# Altium schematic sheet ESP32_TFT1.8_LORASPI.SchDoc
size A4; SheetNumber: 1; SheetTotal: 2
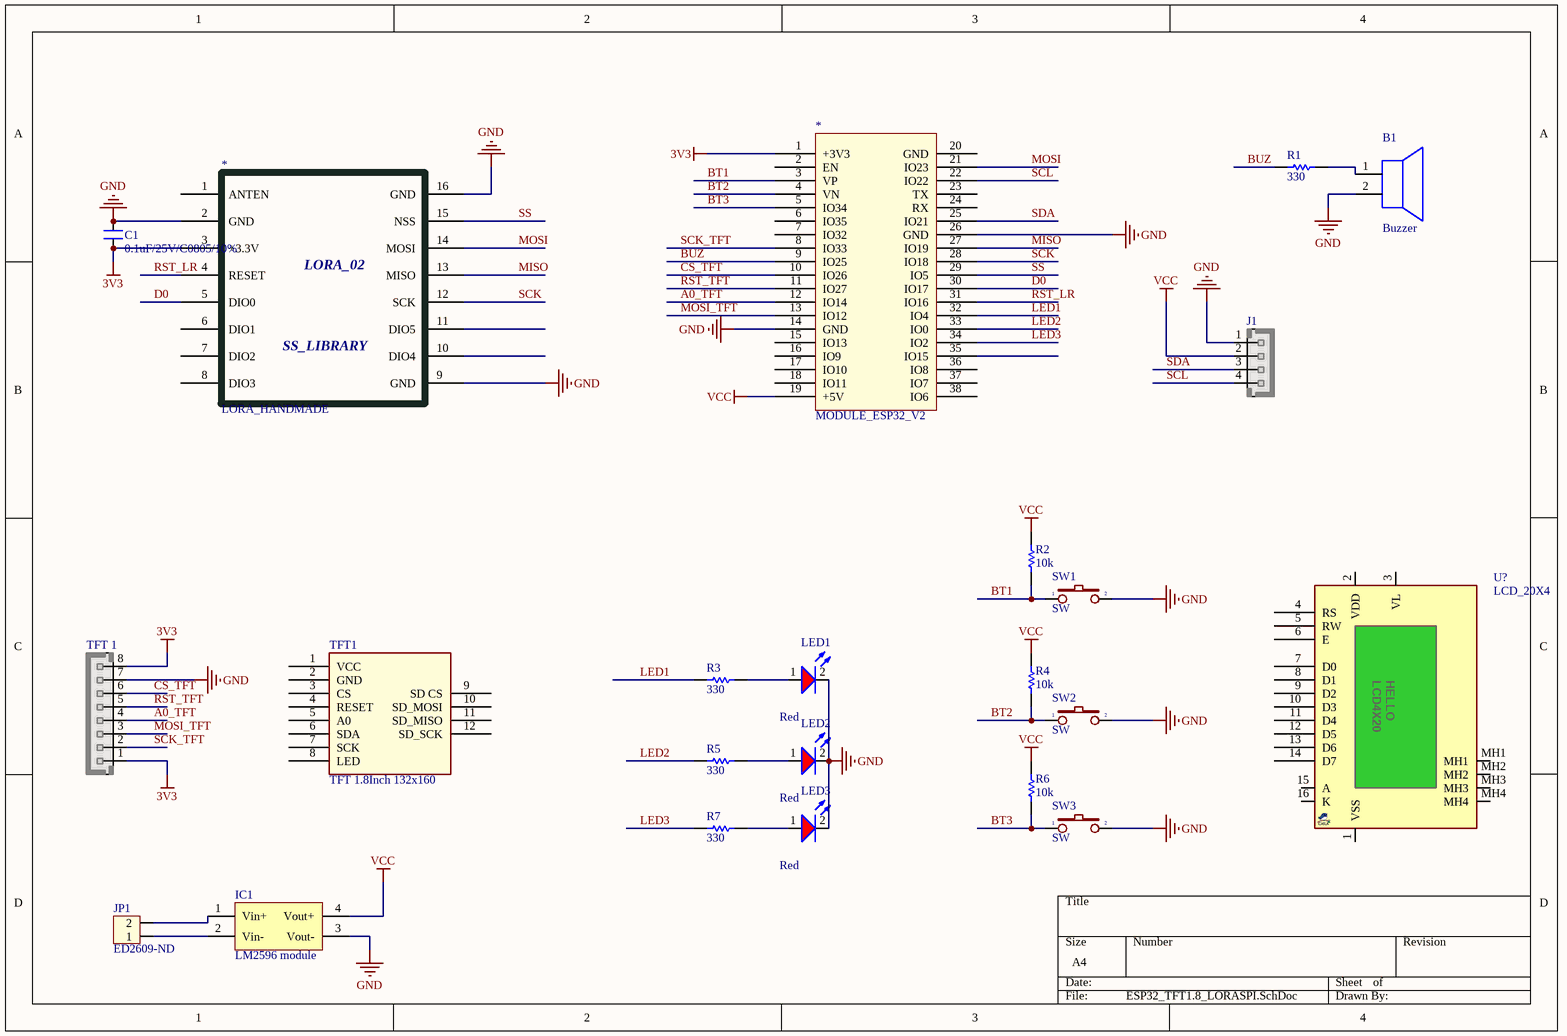
[diagram p0: ESP32_TFT1.8_LORASPI.SchDoc]

## Parts
(Parts that share a designator on the sheet are numbered #1, #2 ... from top to bottom, then left to right.)
*#1  MODULE_ESP32_V2  [MODULE_ESP32_V2]
*#2  LORA_HANDMADE  [LORA_HANDMADE]
B1  Buzzer  [Buzzer]
C1  0.1uF/25V/C0805/10%  [CAP_CERA_C2012(CC0805INCH)]
IC1  LM2596 module  [LM2596 Module]
J1  HHDR_4  [XH_4]  (value not drawn)
JP1  ED2609-ND  [DOMINO_OSTTC_2P]
LED1  value Red  [LED3R]  (hidden comment: LED_R_3)
LED2  value Red  [LED3R]  (hidden comment: LED_R_3)
LED3  value Red  [LED3R]  (hidden comment: LED_R_3)
R1  330  [Res 0805 SMD]
R2  10k  [Res 0805 SMD]
R3  330  [Res 0805 SMD]
R4  10k  [Res 0805 SMD]
R5  330  [Res 0805 SMD]
R6  10k  [Res 0805 SMD]
R7  330  [Res 0805 SMD]
SW1  SW  [BUTTON 2PIN TRON]
SW2  SW  [BUTTON 2PIN TRON]
SW3  SW  [BUTTON 2PIN TRON]
TFT1  TFT 1.8Inch 132x160  [TFT 1.8 132X160]
TFT_1  HHDR_8  [XH_8]  (value not drawn)
U?  LCD_20X4  [LCDCHAR_20X4_GRN]

## Nets
3V3: *#1.1(+3V3) *#2.3(+3.3V) C1.1 TFT_1.1 TFT_1.8
GND: *#1.14(GND) *#1.26(GND) *#2.2(GND) *#2.9(GND) *#2.16(GND) B1.2(-) C1.2 IC1.3(Vout-) J1.1 LED1.2(K) LED2.2(K) LED3.2(K) SW1.2 SW2.2 SW3.2 TFT_1.7
VCC: *#1.19(+5V) IC1.4(Vout+) J1.2 R2.2 R4.2 R6.2
A0_TFT: *#1.12(IO14) TFT_1.4
BT1: *#1.3(VP) R2.1 SW1.1
BT2: *#1.4(VN) R4.1 SW2.1
BT3: *#1.5(IO34) R6.1 SW3.1
BUZ: *#1.9(IO25) R1.1
CS_TFT: *#1.10(IO26) TFT_1.6
D0: *#1.30(IO17) *#2.5(DIO0)
LED1: *#1.32(IO4) R3.1
LED2: *#1.33(IO0) R5.1
LED3: *#1.34(IO2) R7.1
MISO: *#1.27(IO19) *#2.13(MISO)
MOSI: *#1.21(IO23) *#2.14(MOSI)
MOSI_TFT: *#1.13(IO12) TFT_1.3
RST_LR: *#1.31(IO16) *#2.4(RESET)
RST_TFT: *#1.11(IO27) TFT_1.5
SCK: *#1.28(IO18) *#2.12(SCK)
SCK_TFT: *#1.8(IO33) TFT_1.2
SCL: *#1.22(IO22) J1.4
SDA: *#1.25(IO21) J1.3
SS: *#1.29(IO5) *#2.15(NSS)
NetB1_1: B1.1(+) R1.2
NetIC1_1: IC1.1(Vin+) JP1.2
NetIC1_2: IC1.2(Vin-) JP1.1
NetLED1_1: LED1.1(A) R3.2
NetLED2_1: LED2.1(A) R5.2
NetLED3_1: LED3.1(A) R7.2

Not connected (* = marked no-connect by the designer): *#1 2(EN) 6(IO35) 7(IO32) 15(IO13) 16(IO9) 17(IO10) 18(IO11) 20(GND) 23(TX) 24(RX) 35(IO15) 36(IO8) 37(IO7) 38(IO6); *#2 1(ANTEN) 6(DIO1) 7(DIO2) 8(DIO3) 10(DIO4) 11(DIO5); TFT1 1(VCC) 2(GND) 3(CS) 4(RESET) 5(A0) 6(SDA) 7(SCK) 8(LED) 9(SD_CS) 10(SD_MOSI) 11(SD_MISO) 12(SD_SCK); U? 1(VSS) 2(VDD) 3(VL) 4(RS) 5(RW) 6(E) 7(D0) 8(D1) 9(D2) 10(D3) 11(D4) 12(D5) 13(D6) 14(D7) 15(A) 16(K) MH1 MH2 MH3 MH4

## Notes on the sheet
- (in symbol LCDCHAR_20X4_GRN) LCD4X20; HELLO
- (in symbol LORA_HANDMADE) LORA_02; SS_LIBRARY

## Library data of the parts
C1 = CAP CERA 0805: CERAMIC CAP 0805; Value: 100pF, 2012
J1 = XH_4: JST-XH pitch: 2.5mm; VALUE: HHDR_4
JP1 = Con2_1: Connector 2; Value: Connector 2
LED1-LED3 = LED_RED_3MM: LED Red 3mm; ComponentLink1Description: Datasheet; ComponentLink1URL: D:\Dropbox\Datasheets\Opto and Illumination\LEDs\SMD LED.pdf; Unit Price: 0.0476
R1-R7 = RES-0805: RES SMD 249K OHM 1% 1/10W 0805; Manufacturer: Yageo; Manufacturer Part Number: RC0603FR-07249KL; Power (Watts): 0.1W, 1/10W; Temperature Coefficient: ±100ppm/°C; Supplier 1: Digi-Key; RoHS: RoHS Compliant; Category: Resistors; Stock 1: 370515; Pricing 1: 1=0.1, 10=0.015, 100=0.006, 1000=0.00268, 2500=0.00233 (USD); Packaging: Cut Tape (CT); Part Status: Active; Tolerance: ±1%; Composition: Thick Film; Features: Moisture Resistant; Operating Temperature: -55°C ~ 155°C; Package / Case: 0603 (1608 Metric); Supplier Device Package: 0603; Size / Dimension: 0.063" L x 0.032" W (1.60mm x 0.80mm); Height - Seated (Max): 0.022" (0.55mm); Failure Rate: -; ComponentLink1URL: http://www.yageo.com/documents/recent/PYu-RC_Group_51_RoHS_L_8.pdf; ComponentLink1Description: http://www.yageo.com/documents/recent/PYu-RC_Group_51_RoHS_L_8.pdf
SW1-SW3 = SW2: Switch button 2 pin; Value: SW chip 2 pin
TFT_1 = XH_8: JST-XH pitch: 2.5mm; VALUE: HHDR_8
U? = LCDCHAR_20X4_GRN: LCD Character Disp, 20X4; MANF: Sunrom; MANF_P#: JHD204A; PARAM2: Green back, Gray, 5V; PARAM: 4 lines x 20 characters; VALUE: LCD_20X4